# EAGLE design Renesas_Raspi3_Add_On_V1 (EAGLE 9.1.3)
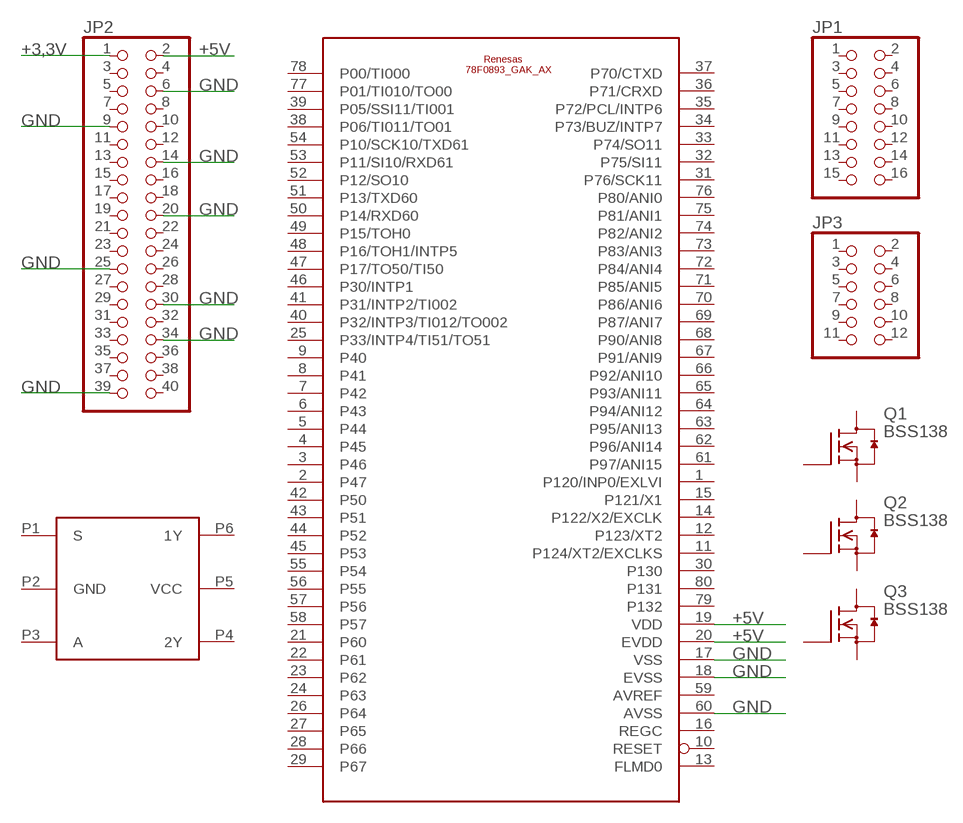
[diagram p0: schematic, sheet 1]

## Parts
74LVC1G18  74LVC1G18  [74LVC1G18]
78F0893  78F0893_GAK_AX  [LQFP80]
JP1  PINHD-2X8  [2X08]
JP2  PINHD-2X20  [2X20]
JP3  PINHD-2X6  [2X06]
Q1  BSS138  [SOT23]
Q2  BSS138  [SOT23]
Q3  BSS138  [SOT23]

## Nets
+3,3V: JP2.1
+5V: 78F0893.19(VDD) 78F0893.20(EVDD) JP2.2
GND: 78F0893.17(VSS) 78F0893.18(EVSS) 78F0893.60(AVSS) JP2.6 JP2.9 JP2.14 JP2.20 JP2.25 JP2.30 JP2.34 JP2.39
Unconnected: 74LVC1G18.P1(S) 74LVC1G18.P2(GND) 74LVC1G18.P3(A) 74LVC1G18.P4(2Y) 74LVC1G18.P5(VCC) 74LVC1G18.P6(1Y) 78F0893.1(P120/INP0/EXLVI) 78F0893.2(P47) 78F0893.3(P46) 78F0893.4(P45) 78F0893.5(P44) 78F0893.6(P43) 78F0893.7(P42) 78F0893.8(P41) 78F0893.9(P40) 78F0893.10(RESET) 78F0893.11(P124/XT2/EXCLKS) 78F0893.12(P123/XT2) 78F0893.13(FLMD0) 78F0893.14(P122/X2/EXCLK) 78F0893.15(P121/X1) 78F0893.16(REGC) 78F0893.21(P60) 78F0893.22(P61) 78F0893.23(P62) 78F0893.24(P63) 78F0893.25(P33/INTP4/TI51/TO51) 78F0893.26(P64) 78F0893.27(P65) 78F0893.28(P66) 78F0893.29(P67) 78F0893.30(P130) 78F0893.31(P76/SCK11) 78F0893.32(P75/SI11) 78F0893.33(P74/SO11) 78F0893.34(P73/BUZ/INTP7) 78F0893.35(P72/PCL/INTP6) 78F0893.36(P71/CRXD) 78F0893.37(P70/CTXD) 78F0893.38(P06/TI011/TO01) 78F0893.39(P05/SSI11/TI001) 78F0893.40(P32/INTP3/TI012/TO002) 78F0893.41(P31/INTP2/TI002) 78F0893.42(P50) 78F0893.43(P51) 78F0893.44(P52) 78F0893.45(P53) 78F0893.46(P30/INTP1) 78F0893.47(P17/TO50/TI50) 78F0893.48(P16/TOH1/INTP5) 78F0893.49(P15/TOH0) 78F0893.50(P14/RXD60) 78F0893.51(P13/TXD60) 78F0893.52(P12/SO10) 78F0893.53(P11/SI10/RXD61) 78F0893.54(P10/SCK10/TXD61) 78F0893.55(P54) 78F0893.56(P55) 78F0893.57(P56) 78F0893.58(P57) 78F0893.61(P97/ANI15) 78F0893.62(P96/ANI14) 78F0893.63(P95/ANI13) 78F0893.64(P94/ANI12) 78F0893.65(P93/ANI11) 78F0893.66(P92/ANI10) 78F0893.67(P91/ANI9) 78F0893.68(P90/ANI8) 78F0893.69(P87/ANI7) 78F0893.70(P86/ANI6) 78F0893.71(P85/ANI5) 78F0893.72(P84/ANI4) 78F0893.73(P83/ANI3) 78F0893.74(P82/ANI2) 78F0893.75(P81/ANI1) 78F0893.76(P80/ANI0) 78F0893.77(P01/TI010/TO00) 78F0893.78(P00/TI000) 78F0893.79(P132) 78F0893.80(P131) JP1.1 JP1.2 JP1.3 JP1.4 JP1.5 JP1.6 JP1.7 JP1.8 JP1.9 JP1.10 JP1.11 JP1.12 JP1.13 JP1.14 JP1.15 JP1.16 JP2.3 JP2.4 JP2.5 JP2.7 JP2.8 JP2.10 JP2.11 JP2.12 JP2.13 JP2.15 JP2.16 JP2.17 JP2.18 JP2.19 JP2.21 JP2.22 JP2.23 JP2.24 JP2.26 JP2.27 JP2.28 JP2.29 JP2.31 JP2.32 JP2.33 JP2.35 JP2.36 JP2.37 JP2.38 JP2.40 JP3.1 JP3.2 JP3.3 JP3.4 JP3.5 JP3.6 JP3.7 JP3.8 JP3.9 JP3.10 JP3.11 JP3.12 Q1.1(G) Q1.2(S) Q1.3(D) Q2.1(G) Q2.2(S) Q2.3(D) Q3.1(G) Q3.2(S) Q3.3(D)

## Power pins joined to a net without a drawn wire
AVREF: 78F0893.59(AVREF)

## Library data of the parts
74LVC1G18 = Hand_Solder_Special:74LVC1G18
78F0893 = Renesas_78k0_0_2:78F0893_GAK_AX
JP1 = pinhead_2mm:PINHD-2X8: PIN HEADER
JP2 = pinhead_2mm:PINHD-2X20: PIN HEADER
JP3 = pinhead_2mm:PINHD-2X6: PIN HEADER
Q1-Q3 = m-pad-2.1:BSS138: Fairchild Semiconductors BSS138 N-Channel Logic Level Enhancement Mode Field Effect Transistor General Description: These N-Channel enhancement mode field effect transistors are produced using Fairchild's proprietary, high cell density, DMOS technology. These products have been designed to minimize on-state resistance while provide rugged, reliable, and fast switching performance.These products are particularly suited for low voltage, low current applications such as small servo motor control, power MOSFET gate drivers, and other switching applications. Features: 0.22 A, 50 V. RDS(ON) = 3.5Ohm @ VGS = 10 V RDS(ON) = 6.0Ohm @ VGS = 4.5 V High density cell design for extremely low RDS(ON) Rugged and Reliable Compact industry standard SOT-23 surface mount package Please send any comments to: messi@users.sourceforge.net

## Board
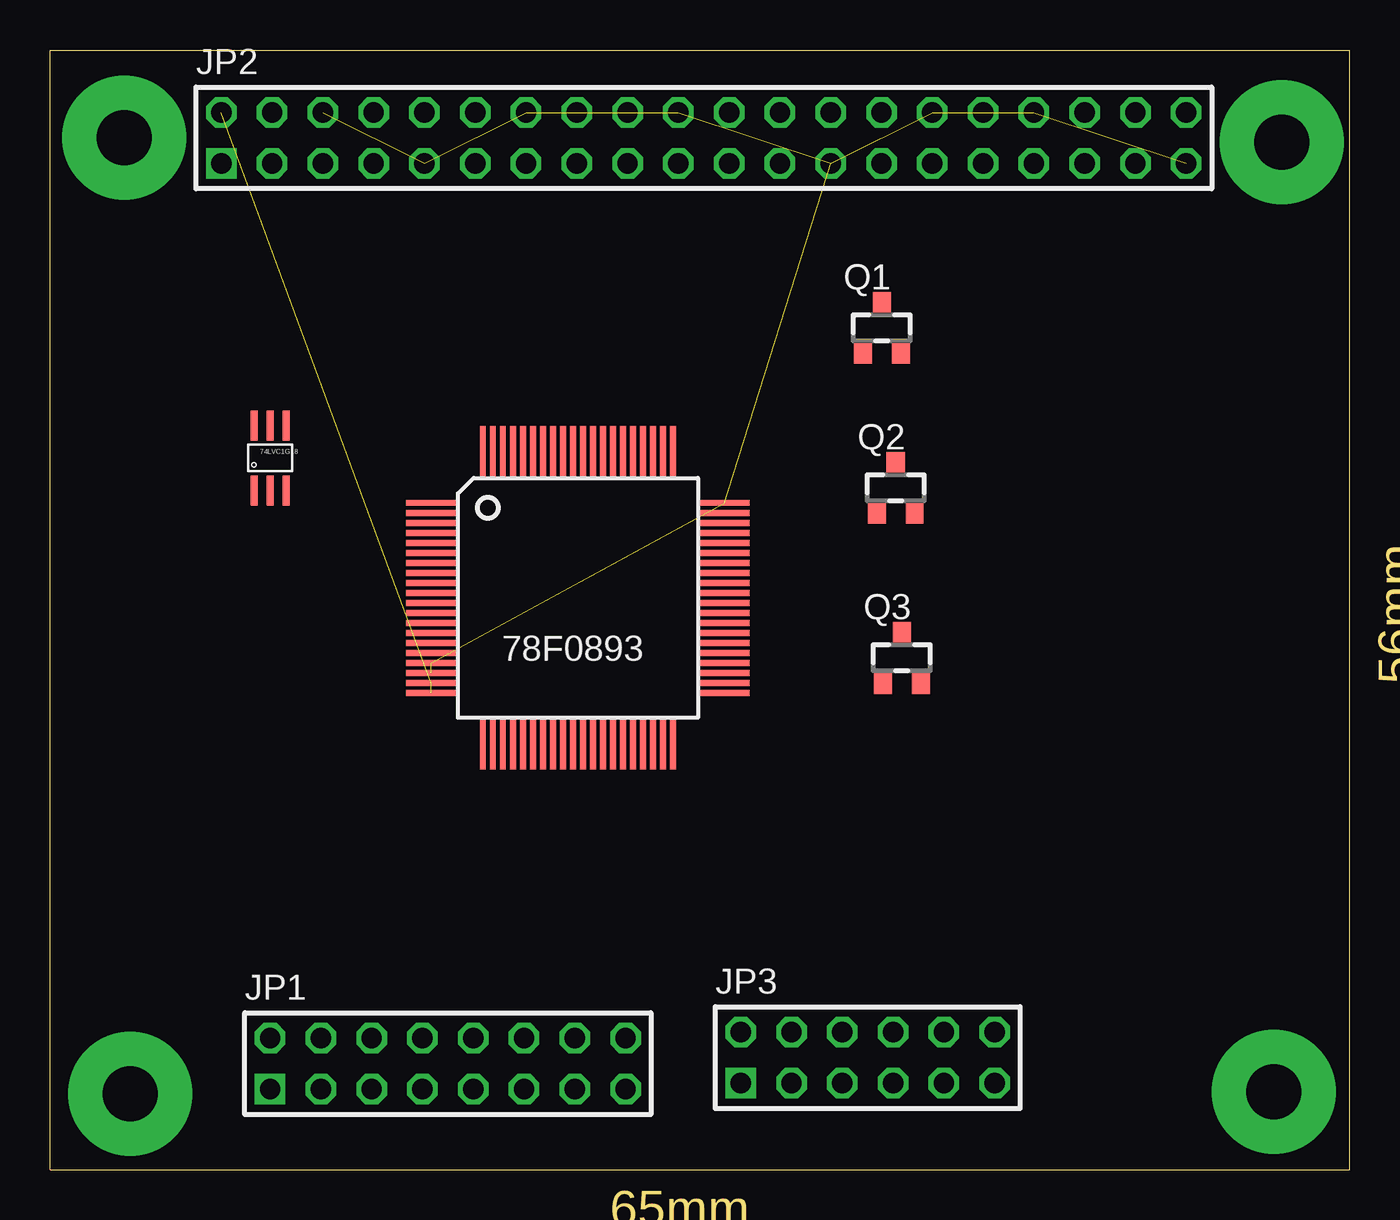
[diagram p1: board, top side]

Size 65 x 56 mm. Coordinates in mm from the lower left corner, seen from the top.
Outline: 0,0 65,0 65,56 0,56 0,0
Copper layers (1*16): Top 0.035mm / dielectric 1.5mm / Bottom 0.035mm
Design rules "default": minimum track width 10mil, minimum drill 24mil, track to track 8mil, track to pad 8mil, pad to pad 8mil, via to via 8mil, smd to smd 8mil, copper to edge 40mil, drill to drill 8mil, minimum pad ring 10mil, minimum via ring 8mil, stop-mask expansion 4mil, vias tented up to drill 0mil, thermal gap 10mil

### Footprints (pad centres in the part's own frame; a part is rotated, then mirrored left to right if it is on the bottom)
74LVC1G18 = smd 0.35 x 1.5: P1 -0.8,-1.65; P2 0,-1.65; P3 0.8,-1.65; P4 0.8,1.6; P5 0,1.6; P6 -0.8,1.6
LQFP80 = smd 2.516 x 0.3: 1 -7.333,4.75; 2 -7.333,4.25; 3 -7.333,3.75; 4 -7.333,3.25; 5 -7.333,2.75; 6 -7.333,2.25; 7 -7.333,1.75; 8 -7.333,1.25; 9 -7.333,0.75; 10 -7.333,0.25; 11 -7.333,-0.25; 12 -7.333,-0.75; 13 -7.333,-1.25; 14 -7.333,-1.75; 15 -7.333,-2.25; 16 -7.333,-2.75; 17 -7.333,-3.25; 18 -7.333,-3.75; 19 -7.333,-4.25; 20 -7.333,-4.75; 41 7.333,-4.75; 42 7.333,-4.25; 43 7.333,-3.75; 44 7.333,-3.25; 45 7.333,-2.75; 46 7.333,-2.25; 47 7.333,-1.75; 48 7.333,-1.25; 49 7.333,-0.75; 50 7.333,-0.25; 51 7.333,0.25; 52 7.333,0.75; 53 7.333,1.25; 54 7.333,1.75; 55 7.333,2.25; 56 7.333,2.75; 57 7.333,3.25; 58 7.333,3.75; 59 7.333,4.25; 60 7.333,4.75 | smd 0.3 x 2.516: 21 -4.75,-7.333; 22 -4.25,-7.333; 23 -3.75,-7.333; 24 -3.25,-7.333; 25 -2.75,-7.333; 26 -2.25,-7.333; 27 -1.75,-7.333; 28 -1.25,-7.333; 29 -0.75,-7.333; 30 -0.25,-7.333; 31 0.25,-7.333; 32 0.75,-7.333; 33 1.25,-7.333; 34 1.75,-7.333; 35 2.25,-7.333; 36 2.75,-7.333; 37 3.25,-7.333; 38 3.75,-7.333; 39 4.25,-7.333; 40 4.75,-7.333; 61 4.75,7.333; 62 4.25,7.333; 63 3.75,7.333; 64 3.25,7.333; 65 2.75,7.333; 66 2.25,7.333; 67 1.75,7.333; 68 1.25,7.333; 69 0.75,7.333; 70 0.25,7.333; 71 -0.25,7.333; 72 -0.75,7.333; 73 -1.25,7.333; 74 -1.75,7.333; 75 -2.25,7.333; 76 -2.75,7.333; 77 -3.25,7.333; 78 -3.75,7.333; 79 -4.25,7.333; 80 -4.75,7.333
2X08 = drill 1.016 square: 1 -8.89,-1.27 | drill 1.016 octagon: 2 -8.89,1.27; 3 -6.35,-1.27; 4 -6.35,1.27; 5 -3.81,-1.27; 6 -3.81,1.27; 7 -1.27,-1.27; 8 -1.27,1.27; 9 1.27,-1.27; 10 1.27,1.27; 11 3.81,-1.27; 12 3.81,1.27; 13 6.35,-1.27; 14 6.35,1.27; 15 8.89,-1.27; 16 8.89,1.27
2X20 = drill 1.016 square: 1 -24.13,-1.27 | drill 1.016 octagon: 2 -24.13,1.27; 3 -21.59,-1.27; 4 -21.59,1.27; 5 -19.05,-1.27; 6 -19.05,1.27; 7 -16.51,-1.27; 8 -16.51,1.27; 9 -13.97,-1.27; 10 -13.97,1.27; 11 -11.43,-1.27; 12 -11.43,1.27; 13 -8.89,-1.27; 14 -8.89,1.27; 15 -6.35,-1.27; 16 -6.35,1.27; 17 -3.81,-1.27; 18 -3.81,1.27; 19 -1.27,-1.27; 20 -1.27,1.27; 21 1.27,-1.27; 22 1.27,1.27; 23 3.81,-1.27; 24 3.81,1.27; 25 6.35,-1.27; 26 6.35,1.27; 27 8.89,-1.27; 28 8.89,1.27; 29 11.43,-1.27; 30 11.43,1.27; 31 13.97,-1.27; 32 13.97,1.27; 33 16.51,-1.27; 34 16.51,1.27; 35 19.05,-1.27; 36 19.05,1.27; 37 21.59,-1.27; 38 21.59,1.27; 39 24.13,-1.27; 40 24.13,1.27
2X06 = drill 1.016 square: 1 -6.35,-1.27 | drill 1.016 octagon: 2 -6.35,1.27; 3 -3.81,-1.27; 4 -3.81,1.27; 5 -1.27,-1.27; 6 -1.27,1.27; 7 1.27,-1.27; 8 1.27,1.27; 9 3.81,-1.27; 10 3.81,1.27; 11 6.35,-1.27; 12 6.35,1.27
SOT23 = smd 0.9 x 1.2: 1 -0.95,-1.2; 2 0.95,-1.2; 3 0,1.2

### Placement (x,y rotation side)
74LVC1G18  11,35.6 0 top
78F0893  26.4,28.6 0 top
JP1  19.9,5.3 0 top
JP2  32.7,51.6 0 top
JP3  40.9,5.6 0 top
Q1  41.6,42.1 0 top
Q2  42.3,34.1 0 top
Q3  42.6,25.6 0 top

### Tracks (layer width: path | path; a pad name or v marks a point on that pad's centre or on a via)
+5V  (2 unrouted)
GND  (10 unrouted)
N$2  (via drill 2.75 pad 6.2)
  other vias: 3.7,51.6 4,3.8 61.6,51.4 61.2,3.9

### Text on the board
Dimension: 56mm | 65mm